# Altium schematic sheet Sheet1.SchDoc
size A2
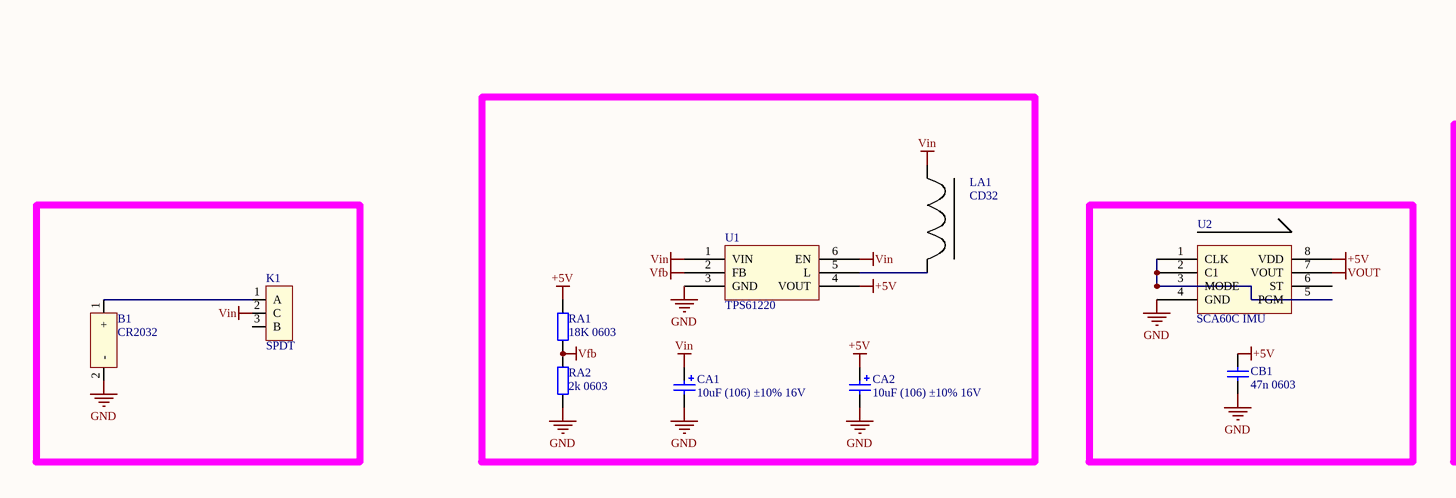
[diagram p0: Sheet1.SchDoc, left]
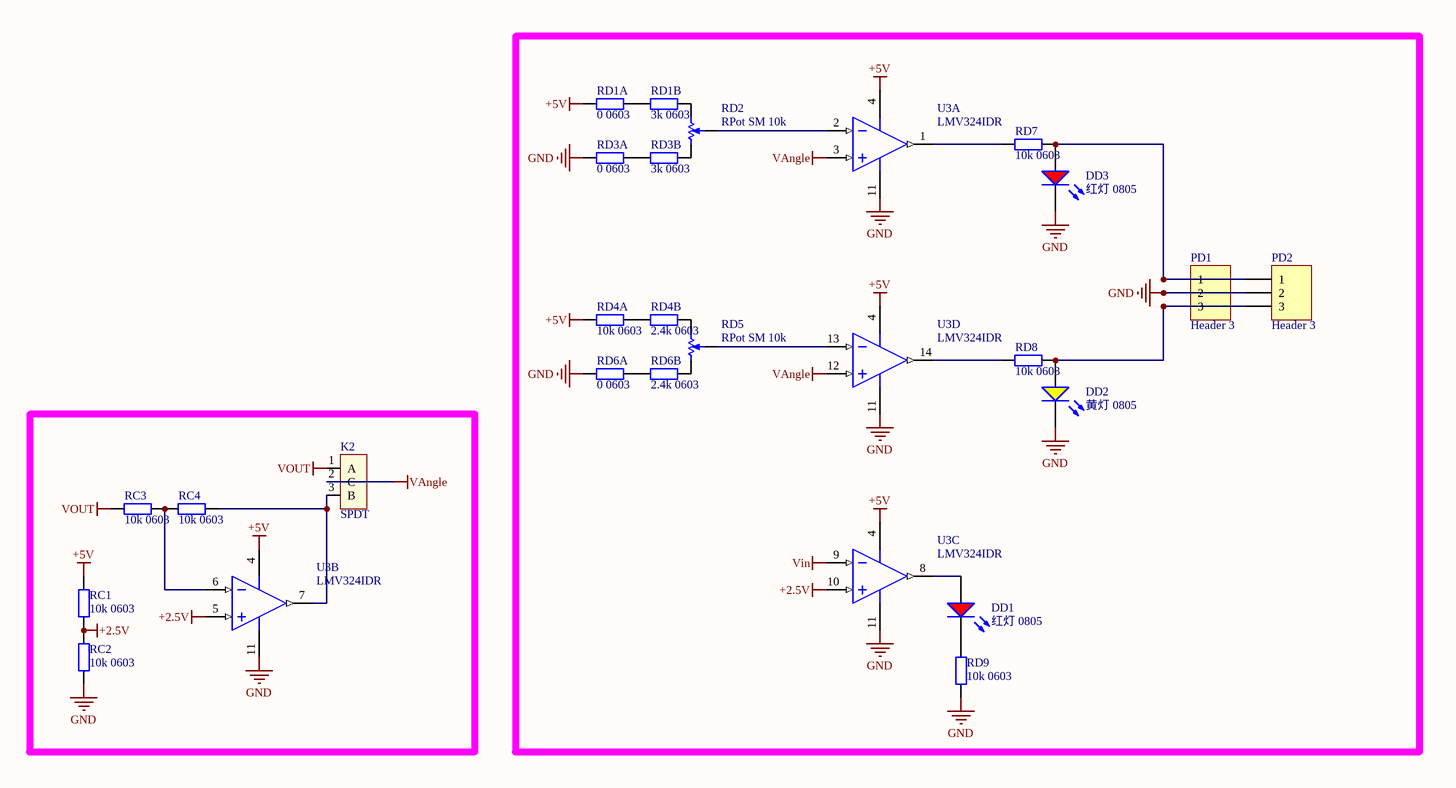
[diagram p1: Sheet1.SchDoc, right]

## Parts
B1  CR2032  [CR2032]
CA1  10uF (106) ±10% 16V  [LC-CASE-A_3216]
CA2  10uF (106) ±10% 16V  [LC-CASE-A_3216]
CB1  47n 0603  [LC-0603_C]
DD1  红灯 0805  [LC-0805_LED_S1]
DD2  黄灯 0805  [LC-0805_LED_S1]
DD3  红灯 0805  [LC-0805_LED_S1]
K1  SPDT  [MSS22D18G2]
K2  SPDT  [MSS22D18G2]
LA1  CD32  [CD32]
PD1  Header 3  [HDR1X3]
PD2  Header 3  [HDR1X3]
RA1  18K 0603  [LC-0603_R]
RA2  2k 0603  [LC-0603_R]
RC1  10k 0603  [LC-0603_R]
RC2  10k 0603  [LC-0603_R]
RC3  10k 0603  [LC-0603_R]
RC4  10k 0603  [LC-0603_R]
RD1A  0 0603  [LC-0603_R]
RD1B  3k 0603  [LC-0603_R]
RD2  RPot SM 10k  [POT4MM-2]
RD3A  0 0603  [LC-0603_R]
RD3B  3k 0603  [LC-0603_R]
RD4A  10k 0603  [LC-0603_R]
RD4B  2.4k 0603  [LC-0603_R]
RD5  RPot SM 10k  [POT4MM-2]
RD6A  0 0603  [LC-0603_R]
RD6B  2.4k 0603  [LC-0603_R]
RD7  10k 0603  [LC-0603_R]
RD8  10k 0603  [LC-0603_R]
RD9  10k 0603  [LC-0603_R]
U1  TPS61220  [TPS61220]
U2  SCA60C IMU  [SCA60C]
U3  LMV324IDR  [LC-SOIC-14_150mil]  (parts A,B,C,D of 4)

## Nets
+2.5V: RC1.1 RC2.2 U3.5(INB+) U3.10(INC+)
+5V: CA2.1 CB1.2 RA1.2 RC1.2 RD1A.2 RD4A.2 U1.4(VOUT) U2.8(VDD) U3.4(V+)
GND: B1.2(-) CA1.2 CA2.2 CB1.1 DD2.K DD3.K PD1.2 PD2.2 RA2.1 RC2.1 RD3A.2 RD6A.2 RD9.1 U1.3(GND) U2.4(GND) U3.11(V-)
VAngle: K2.2(C) U3.3(INA+) U3.12(IND+)
Vfb: RA1.1 RA2.2 U1.2(FB)
Vin: CA1.1 K1.2(C) LA1.1 U1.1(VIN) U1.6(EN) U3.9(INC-)
VOUT: K2.1(A) RC3.2 U2.7(VOUT)
NetB1_1: B1.1(+) K1.1(A)
NetDD1_A: DD1.A U3.8(OUTC)
NetDD1_K: DD1.K RD9.2
NetDD2_A: DD2.A PD1.3 PD2.3 RD8.2
NetDD3_A: DD3.A PD1.1 PD2.1 RD7.1
NetK2_3: K2.3(B) RC4.1 U3.7(OUTB)
NetLA1_2: LA1.2 U1.5(L)
NetRC3_1: RC3.1 RC4.2 U3.6(INB-)
NetRD1A_1: RD1A.1 RD1B.2
NetRD1B_1: RD1B.1 RD2.CW(+)
NetRD2_CCW: RD2.CCW(-) RD3B.1
NetRD2_W: RD2.W U3.2(INA-)
NetRD3A_1: RD3A.1 RD3B.2
NetRD4A_1: RD4A.1 RD4B.2
NetRD4B_1: RD4B.1 RD5.CW(+)
NetRD5_CCW: RD5.CCW(-) RD6B.1
NetRD5_W: RD5.W U3.13(IND-)
NetRD6A_1: RD6A.1 RD6B.2
NetRD7_2: RD7.2 U3.1(OUTA)
NetRD8_1: RD8.1 U3.14(OUTD)
NetU2_1: U2.1(CLK) U2.2(C1) U2.3(MODE) U2.5(PGM)

Not connected (* = marked no-connect by the designer): K1 3(B); U2 6(ST)

## Library data of the parts
B1 = CR2032: Battery
CA1 CA2 = 3216 10uF (106) 10% 16V: 钽电容; ComponentLink1Description: 供应商链接; ComponentLink1URL: http://www.szlcsc.com/product/details_7643.html; Package: 3216; Supplier: LC; SuppliersPartNumber: C7171
CB1 = 0603 4.7nF (472) 10% 50V: 贴片电容; ComponentLink1Description: 供应商链接; ComponentLink1URL: http://www.szlcsc.com/product/details_55004.html; Package: 0603; Supplier: LC; SuppliersPartNumber: C53987
DD1 DD3 = 0805 红灯: 发光二极管; ComponentLink1Description: 供应商链接; ComponentLink1URL: http://www.szlcsc.com/product/details_2668.html; Package: 0805; Supplier: LC; SuppliersPartNumber: C2295
DD2 = 0805 黄灯: 发光二极管; ComponentLink1Description: 供应商链接; ComponentLink1URL: http://www.szlcsc.com/product/details_2669.html; Package: 0805; Supplier: LC; SuppliersPartNumber: C2296
K1 K2 = MSS22D18G2
PD1 PD2 = Header 3: Header, 3-Pin; LatestRevisionDate: 17-Jul-2002; LatestRevisionNote: Re-released for DXP Platform.; Publisher: Altium Limited
RA1 RA2 RC1-RC4 RD1A RD1B RD3A RD3B RD4A RD4B RD6A RD6B RD7-RD9 = 0603 68Ω (68R0) 1%: 贴片电阻; ComponentLink1Description: 供应商链接; ComponentLink1URL: http://www.szlcsc.com/product/details_28341.html; Package: 0603; Supplier: LC; SuppliersPartNumber: C27592
RD2 RD5 = RPot SM: Square Trimming Potentiometer; Published: 17-Dec-2003; DatasheetVersion: Oct-2003; PackageReference: POT4MM-2; Publisher: Altium Limited; PackageDescription: Square Trimming Potentiometer; ComponentLink1Description: Manufacturer Link; ComponentLink1URL: http://bourns.com/2/search.html
U1 = TPS61220: Boost
U2 = SCA60C: Angle Sensor
U3 = LMV324IDR: 运放; ComponentLink1Description: 供应商链接; ComponentLink1URL: http://www.szlcsc.com/product/details_8451.html; Package: SOIC-14_150mil; Supplier: LC; SuppliersPartNumber: C7974